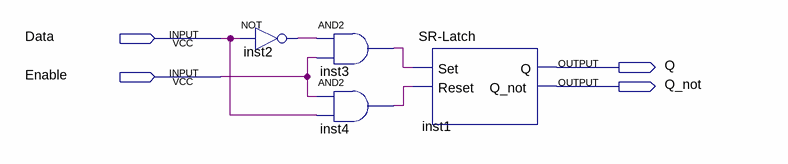
[diagram p0: schematic sheet]
// Quartus schematic D-Latch.bdf as structural Verilog: 4 symbols, 4 pins
module \D-Latch  (
  input  Data,
  input  Enable,
  output Q,
  output Q_not
);

  wire inst2_out, inst3_out, inst4_out;

  not inst2 (inst2_out, Data);
  and inst3 (inst3_out, inst2_out, Enable);
  and inst4 (inst4_out, Enable, Data);
  \SR-Latch  inst1 (.Set(inst3_out), .Reset(inst4_out), .Q(Q), .Q_not(Q_not));
endmodule
